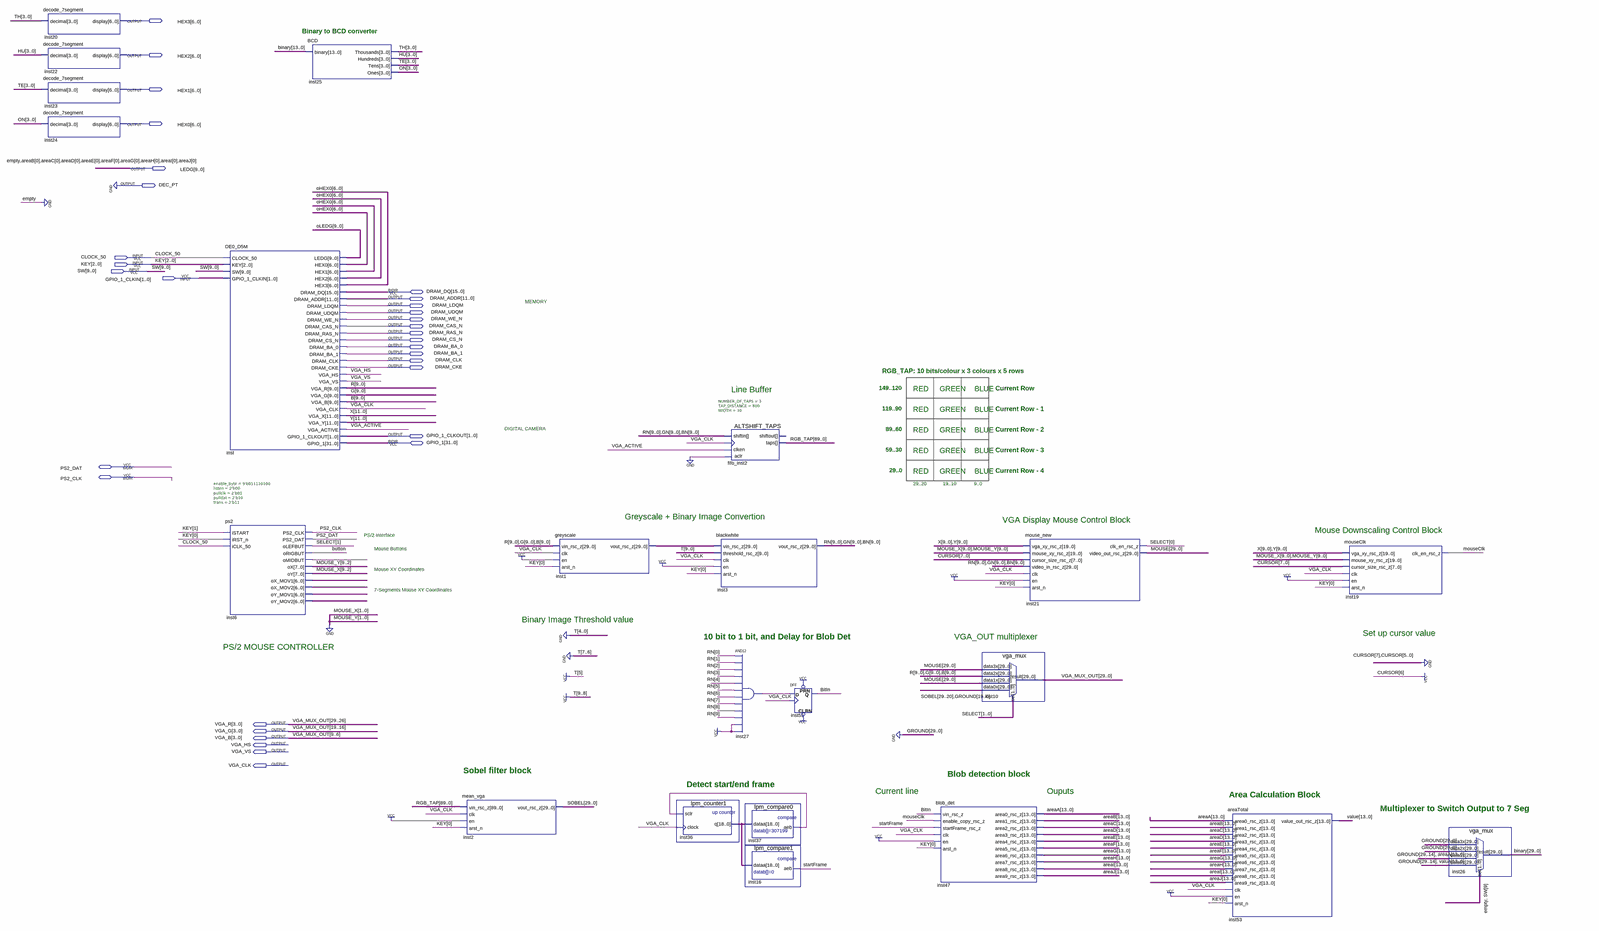
[diagram p0: schematic sheet, whole]
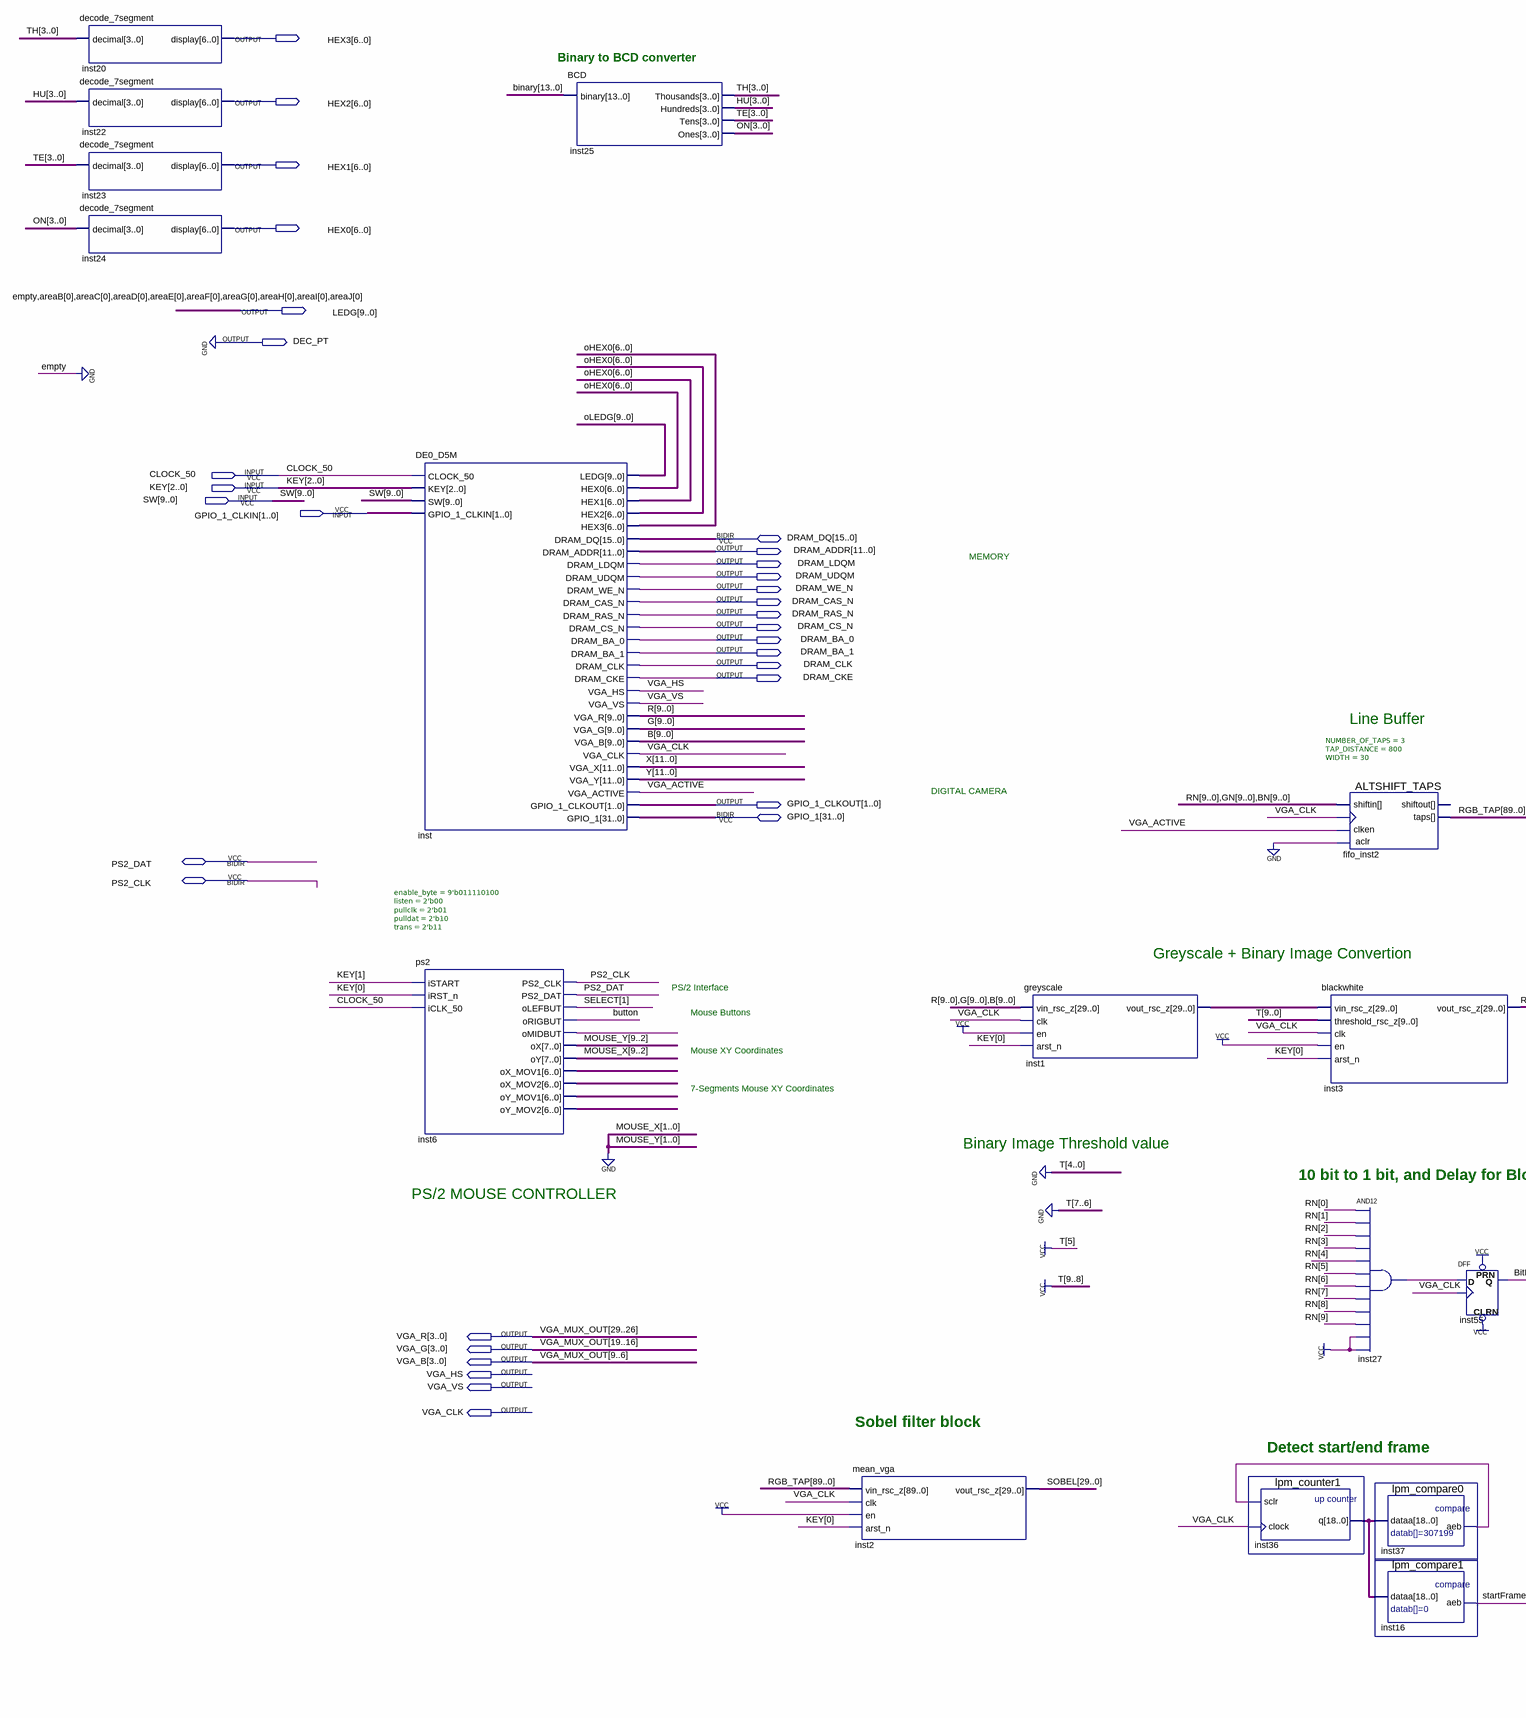
[diagram p1: schematic sheet, left part]
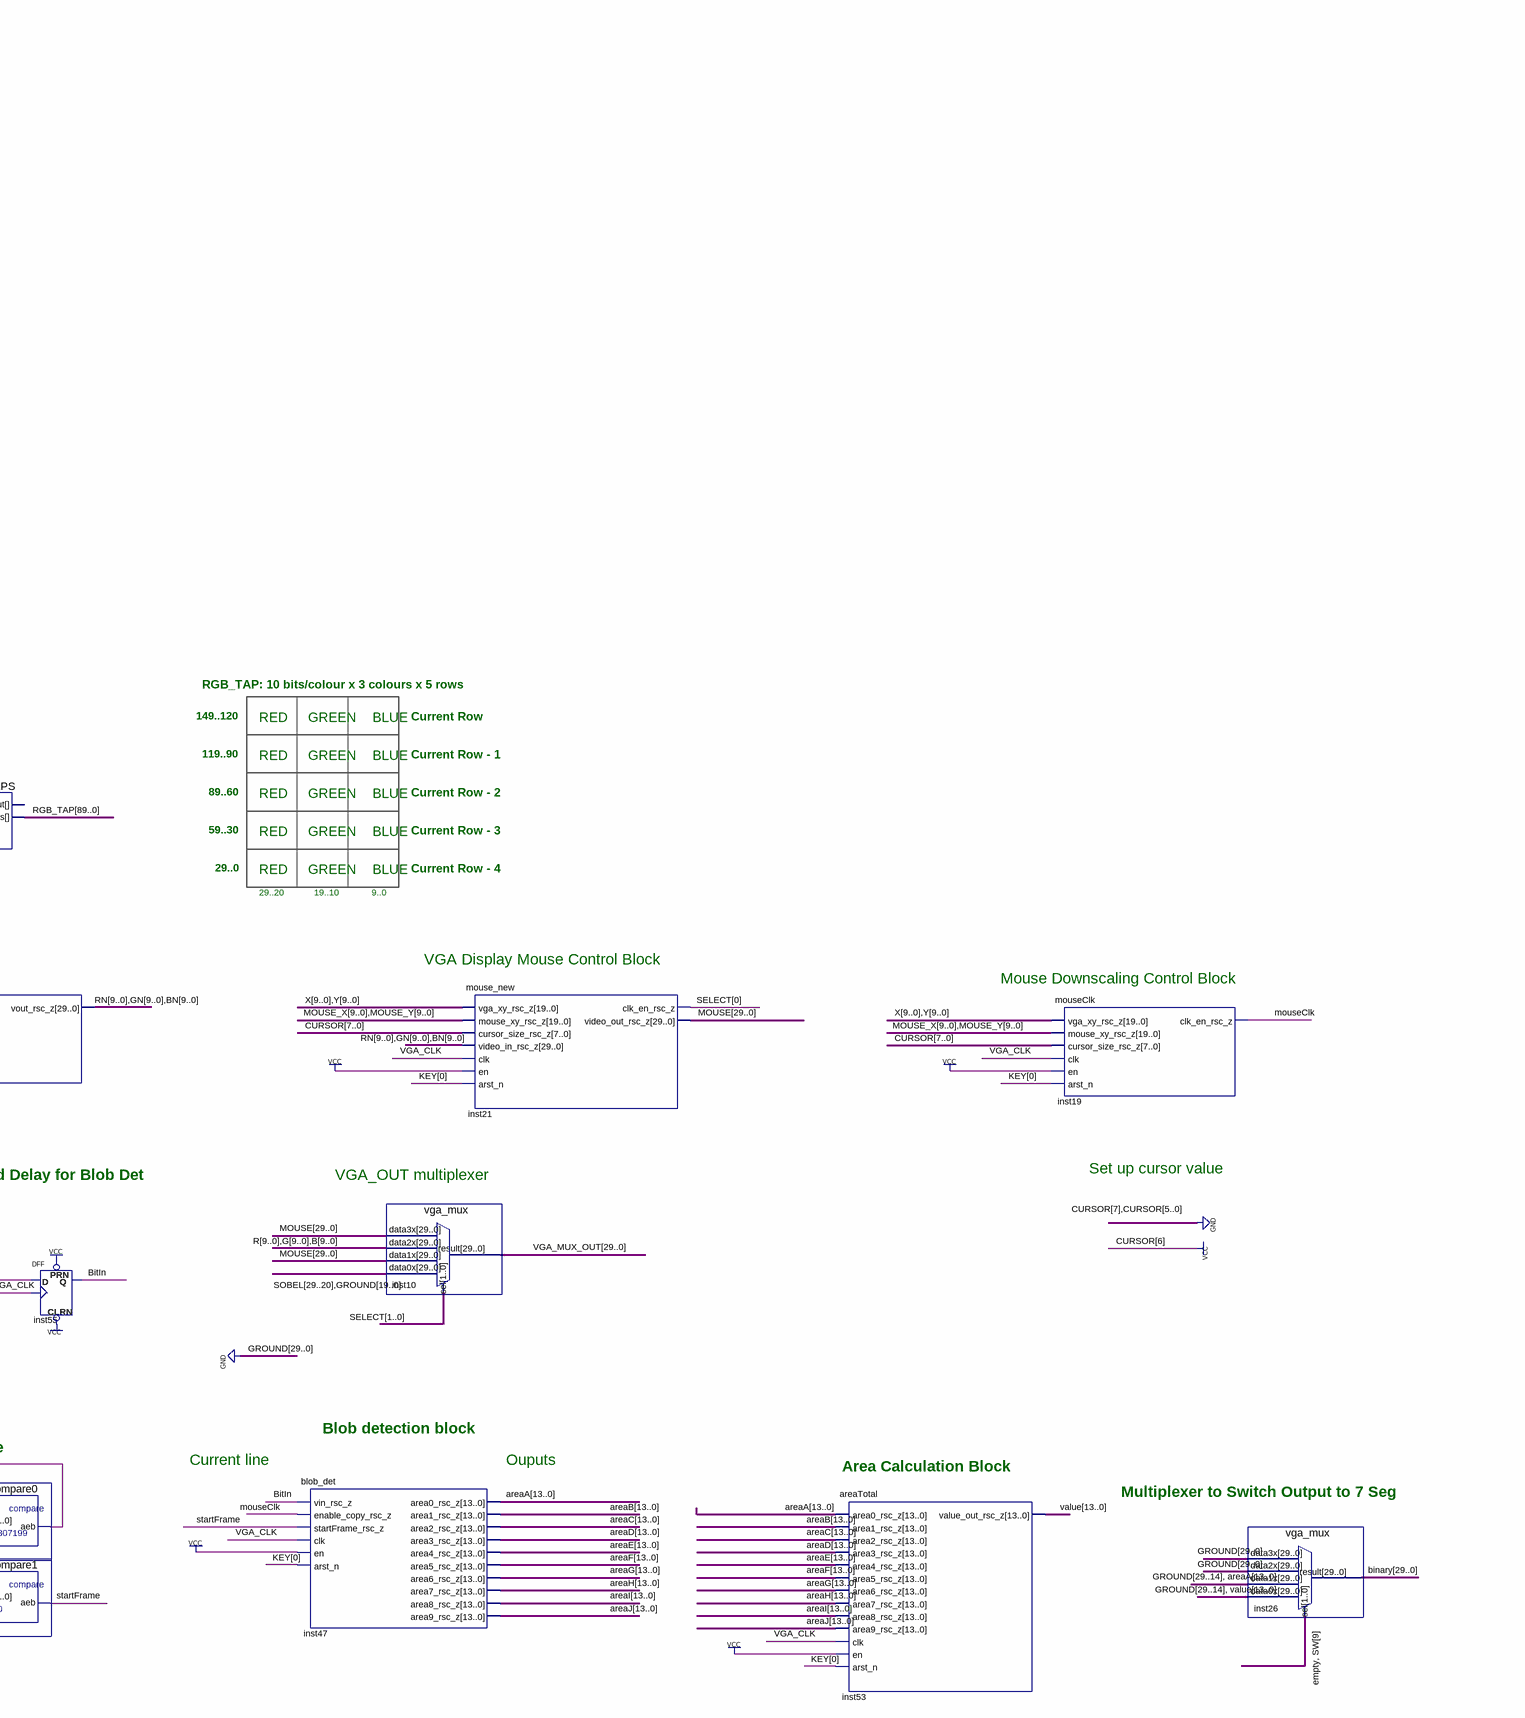
[diagram p2: schematic sheet, right part]
// Quartus schematic TOP_DE0_CAMERA_MOUSE.bdf as structural Verilog: 22 symbols, 32 pins
module TOP_DE0_CAMERA_MOUSE (
  input  CLOCK_50,
  input  [2:0] KEY,
  input  [9:0] SW,
  input  [1:0] GPIO_1_CLKIN,
  inout  [15:0] DRAM_DQ,
  inout  [31:0] GPIO_1,
  inout  PS2_DAT,
  inout  PS2_CLK,
  output [6:0] HEX3,
  output [6:0] HEX2,
  output [6:0] HEX1,
  output [6:0] HEX0,
  output [9:0] LEDG,
  output DEC_PT,
  output [11:0] DRAM_ADDR,
  output DRAM_LDQM,
  output DRAM_UDQM,
  output DRAM_WE_N,
  output DRAM_CAS_N,
  output DRAM_RAS_N,
  output DRAM_CS_N,
  output DRAM_BA_0,
  output DRAM_BA_1,
  output DRAM_CLK,
  output DRAM_CKE,
  output [1:0] GPIO_1_CLKOUT,
  output [3:0] VGA_R,
  output [3:0] VGA_G,
  output [3:0] VGA_B,
  output VGA_HS,
  output VGA_VS,
  output VGA_CLK
);

  wire BitIn, button, inst6_omidbut, inst27_out, inst37_aeb, mouseClk, startFrame, VGA_ACTIVE;
  wire [1:0] SELECT;
  wire [3:0] HU, ON, TE, TH;
  wire [6:0] inst6_ox_mov1, inst6_ox_mov2, inst6_oy_mov1, inst6_oy_mov2, oHEX0;
  wire [9:0] B, BN, G, GN, MOUSE_X, oLEDG, R, RN;
  wire [9:2] MOUSE_Y;
  wire [11:0] X, Y;
  wire [13:0] areaA, value;
  wire [13:1] areaB, areaC, areaD, areaE, areaF, areaG, areaH, areaI, areaJ;
  wire [18:0] inst36_q;
  wire [25:0] VGA_MUX_OUT;
  wire [29:0] binary, inst1_vout_rsc_z, MOUSE, SOBEL;
  wire [89:0] RGB_TAP;

  decode_7segment inst20 (.decimal(TH), .display(HEX3));
  decode_7segment inst22 (.decimal(HU), .display(HEX2));
  decode_7segment inst23 (.decimal(TE), .display(HEX1));
  decode_7segment inst24 (.decimal(ON), .display(HEX0));
  DE0_D5M inst (
    .CLOCK_50(CLOCK_50), .KEY(KEY), .SW(SW), .GPIO_1_CLKIN(GPIO_1_CLKIN), .LEDG(oLEDG), .HEX0(oHEX0),
    .HEX1(oHEX0), .HEX2(oHEX0), .HEX3(oHEX0), .DRAM_ADDR(DRAM_ADDR), .DRAM_LDQM(DRAM_LDQM),
    .DRAM_UDQM(DRAM_UDQM), .DRAM_WE_N(DRAM_WE_N), .DRAM_CAS_N(DRAM_CAS_N), .DRAM_RAS_N(DRAM_RAS_N),
    .DRAM_CS_N(DRAM_CS_N), .DRAM_BA_0(DRAM_BA_0), .DRAM_BA_1(DRAM_BA_1), .DRAM_CLK(DRAM_CLK),
    .DRAM_CKE(DRAM_CKE), .VGA_HS(VGA_HS), .VGA_VS(VGA_VS), .VGA_R(R), .VGA_G(G), .VGA_B(B),
    .VGA_CLK(VGA_CLK), .VGA_X(X), .VGA_Y(Y), .VGA_ACTIVE(VGA_ACTIVE), .GPIO_1_CLKOUT(GPIO_1_CLKOUT),
    .DRAM_DQ(DRAM_DQ), .GPIO_1(GPIO_1));
  ps2 #(.enable_byte(9'b011110100), .listen(2'b00), .pullclk(2'b01), .pulldat(2'b10), .trans(2'b11)) inst6 (
    .iSTART(KEY[1]), .iRST_n(KEY[0]), .iCLK_50(CLOCK_50), .oLEFBUT(SELECT[1]), .oRIGBUT(button),
    .oMIDBUT(inst6_omidbut), .oX(MOUSE_Y), .oY(MOUSE_X[9:2]), .oX_MOV1(inst6_ox_mov1),
    .oX_MOV2(inst6_ox_mov2), .oY_MOV1(inst6_oy_mov1), .oY_MOV2(inst6_oy_mov2), .PS2_CLK(PS2_CLK),
    .PS2_DAT(PS2_DAT));
  BCD inst25 (.binary(binary[13:0]), .Thousands(TH), .Hundreds(HU), .Tens(TE), .Ones(ON));
  mean_vga inst2 (.vin_rsc_z(RGB_TAP), .clk(VGA_CLK), .en(1'b1), .arst_n(KEY[0]), .vout_rsc_z(SOBEL));
  greyscale inst1 (.vin_rsc_z({R, G, B}), .clk(VGA_CLK), .en(1'b1), .arst_n(KEY[0]), .vout_rsc_z(inst1_vout_rsc_z));
  lpm_counter1 inst36 (.sclr(inst37_aeb), .clock(VGA_CLK), .q(inst36_q));
  blackwhite inst3 (
    .vin_rsc_z(inst1_vout_rsc_z), .threshold_rsc_z(10'b1100100000), .clk(VGA_CLK), .en(1'b1),
    .arst_n(KEY[0]), .vout_rsc_z({RN, GN, BN}));
  ALTSHIFT_TAPS #(.NUMBER_OF_TAPS(3), .TAP_DISTANCE(800), .WIDTH(30)) fifo_inst2 (
    .shiftin({RN, GN, BN}), .clken(VGA_ACTIVE), .clock(VGA_CLK), .aclr(1'b0), .taps(RGB_TAP));  // open: shiftout
  and inst27 (inst27_out, RN[0], RN[1], RN[2], RN[3], RN[4], RN[5], RN[6], RN[7], RN[8], RN[9], 1'b1, 1'b1);
  lpm_compare0 inst37 (.dataa(inst36_q), .aeb(inst37_aeb));
  lpm_compare1 inst16 (.dataa(inst36_q), .aeb(startFrame));
  DFF inst55 (.CLRN(1'b1), .CLK(VGA_CLK), .D(inst27_out), .PRN(1'b1), .Q(BitIn));
  blob_det inst47 (
    .vin_rsc_z(BitIn), .enable_copy_rsc_z(mouseClk), .startFrame_rsc_z(startFrame), .clk(VGA_CLK), .en(1'b1),
    .arst_n(KEY[0]), .area0_rsc_z(areaA), .area1_rsc_z({areaB, LEDG[8]}), .area2_rsc_z({areaC, LEDG[7]}),
    .area3_rsc_z({areaD, LEDG[6]}), .area4_rsc_z({areaE, LEDG[5]}), .area5_rsc_z({areaF, LEDG[4]}),
    .area6_rsc_z({areaG, LEDG[3]}), .area7_rsc_z({areaH, LEDG[2]}), .area8_rsc_z({areaI, LEDG[1]}),
    .area9_rsc_z({areaJ, LEDG[0]}));
  vga_mux inst10 (
    .data3x(MOUSE), .data2x({R, G, B}), .data1x(MOUSE), .data0x({SOBEL[29:20], {20{1'b0}}}), .sel(SELECT),
    .result({VGA_R, VGA_MUX_OUT[25:20], VGA_G, VGA_MUX_OUT[15:10], VGA_B, VGA_MUX_OUT[5:0]}));
  mouse_new inst21 (
    .vga_xy_rsc_z({X[9:0], Y[9:0]}), .mouse_xy_rsc_z({MOUSE_X, MOUSE_Y, 2'b00}),
    .cursor_size_rsc_z(8'b01000000), .video_in_rsc_z({RN, GN, BN}), .clk(VGA_CLK), .en(1'b1),
    .arst_n(KEY[0]), .clk_en_rsc_z(SELECT[0]), .video_out_rsc_z(MOUSE));
  areaTotal inst53 (
    .area0_rsc_z(areaA), .area1_rsc_z({areaB, LEDG[8]}), .area2_rsc_z({areaC, LEDG[7]}),
    .area3_rsc_z({areaD, LEDG[6]}), .area4_rsc_z({areaE, LEDG[5]}), .area5_rsc_z({areaF, LEDG[4]}),
    .area6_rsc_z({areaG, LEDG[3]}), .area7_rsc_z({areaH, LEDG[2]}), .area8_rsc_z({areaI, LEDG[1]}),
    .area9_rsc_z({areaJ, LEDG[0]}), .clk(VGA_CLK), .en(1'b1), .arst_n(KEY[0]), .value_out_rsc_z(value));
  mouseClk inst19 (
    .vga_xy_rsc_z({X[9:0], Y[9:0]}), .mouse_xy_rsc_z({MOUSE_X, MOUSE_Y, 2'b00}),
    .cursor_size_rsc_z(8'b01000000), .clk(VGA_CLK), .en(1'b1), .arst_n(KEY[0]), .clk_en_rsc_z(mouseClk));
  vga_mux inst26 (
    .data3x({30{1'b0}}), .data2x({30{1'b0}}), .data1x({{16{1'b0}}, areaA}), .data0x({{16{1'b0}}, value}),
    .sel({1'b0, SW[9]}), .result(binary));

  assign DEC_PT = 1'b0;
  assign LEDG[9] = 1'b0;

  // Other names for the same wires on the sheet: areaB[0] = LEDG[8]; areaC[0] = LEDG[7]; areaD[0] = LEDG[6];
  //   areaE[0] = LEDG[5]; areaF[0] = LEDG[4]; areaG[0] = LEDG[3]; areaH[0] = LEDG[2]; areaI[0] = LEDG[1];
  //   areaJ[0] = LEDG[0]; VGA_MUX_OUT (some bits) = {VGA_R, VGA_G, VGA_B}

  // Notes on the sheet:
  //   Binary to BCD converter
  //   MEMORY
  //   RGB_TAP: 10 bits/colour x 3 colours x 5 rows
  //   Line Buffer
  //   149..120
  //   RED     GREEN    BLUE
  //   Current Row
  //   119..90
  //   RED     GREEN    BLUE
  //   Current Row - 1
  //   DIGITAL CAMERA
  //   89..60
  //   RED     GREEN    BLUE
  //   Current Row - 2
  //   59..30
  //   RED     GREEN    BLUE
  //   Current Row - 3
  //   29..0
  //   RED     GREEN    BLUE
  //   Current Row - 4
  //   29..20            19..10             9..0
  //   Greyscale + Binary Image Convertion
  //   VGA Display Mouse Control Block
  //   Mouse Downscaling Control Block
  //   PS/2 Interface
  //   Mouse Buttons
  //   Mouse XY Coordinates
  //   7-Segments Mouse XY Coordinates
  //   Binary Image Threshold value
  //   Set up cursor value
  //   10 bit to 1 bit, and Delay for Blob Det
  //   VGA_OUT multiplexer
  //   PS/2 MOUSE CONTROLLER
  //   Sobel filter block
  //   Blob detection block
  //   Detect start/end frame
  //   Current line
  //   Ouputs
  //   Area Calculation Block
  //   Multiplexer to Switch Output to 7 Seg
endmodule
